# EAGLE design Anchor PCB V2 (EAGLE 9.2.0)
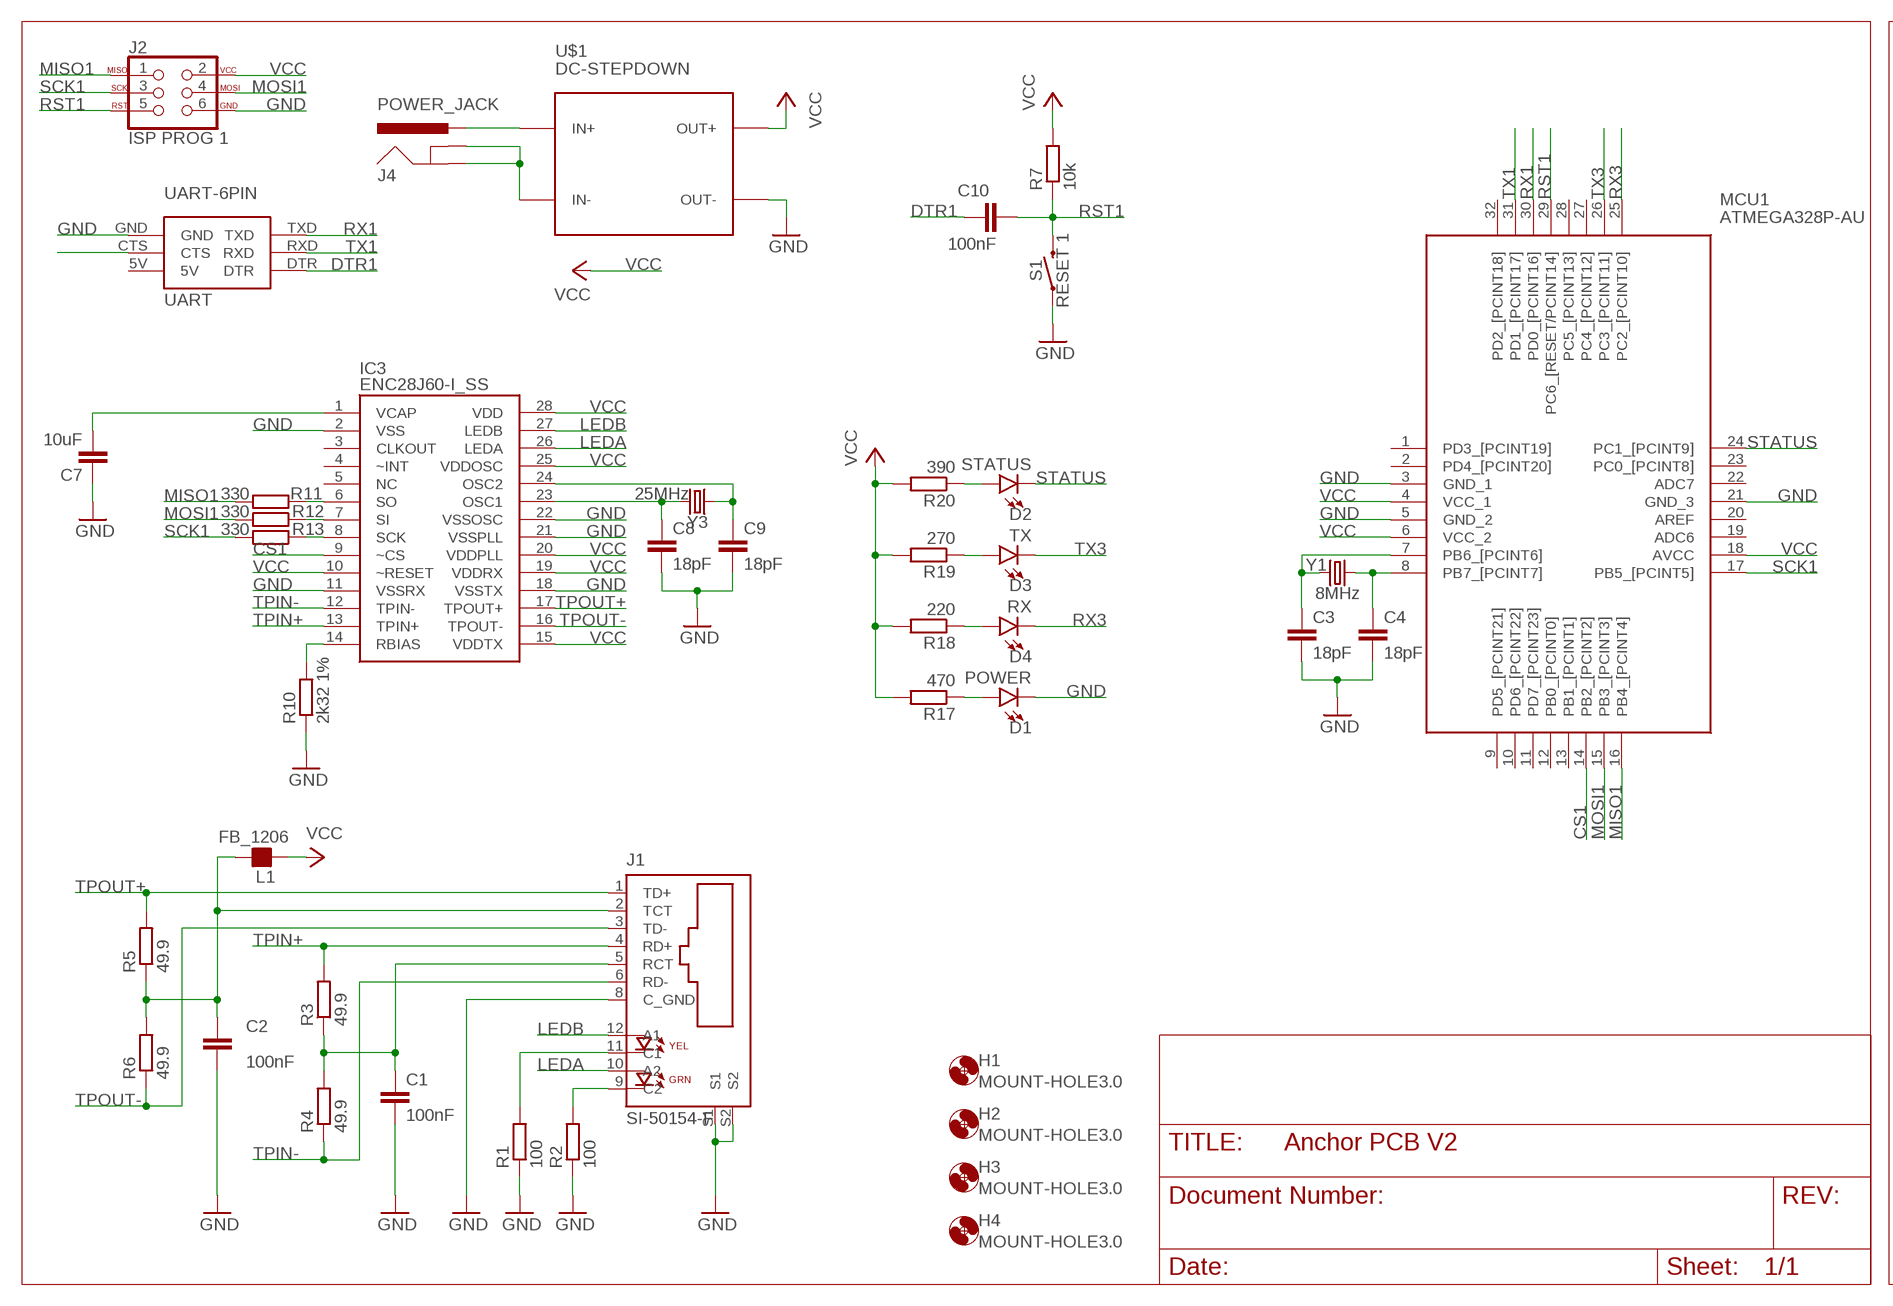
[diagram p0: schematic, sheet 1, part 1 of 2]
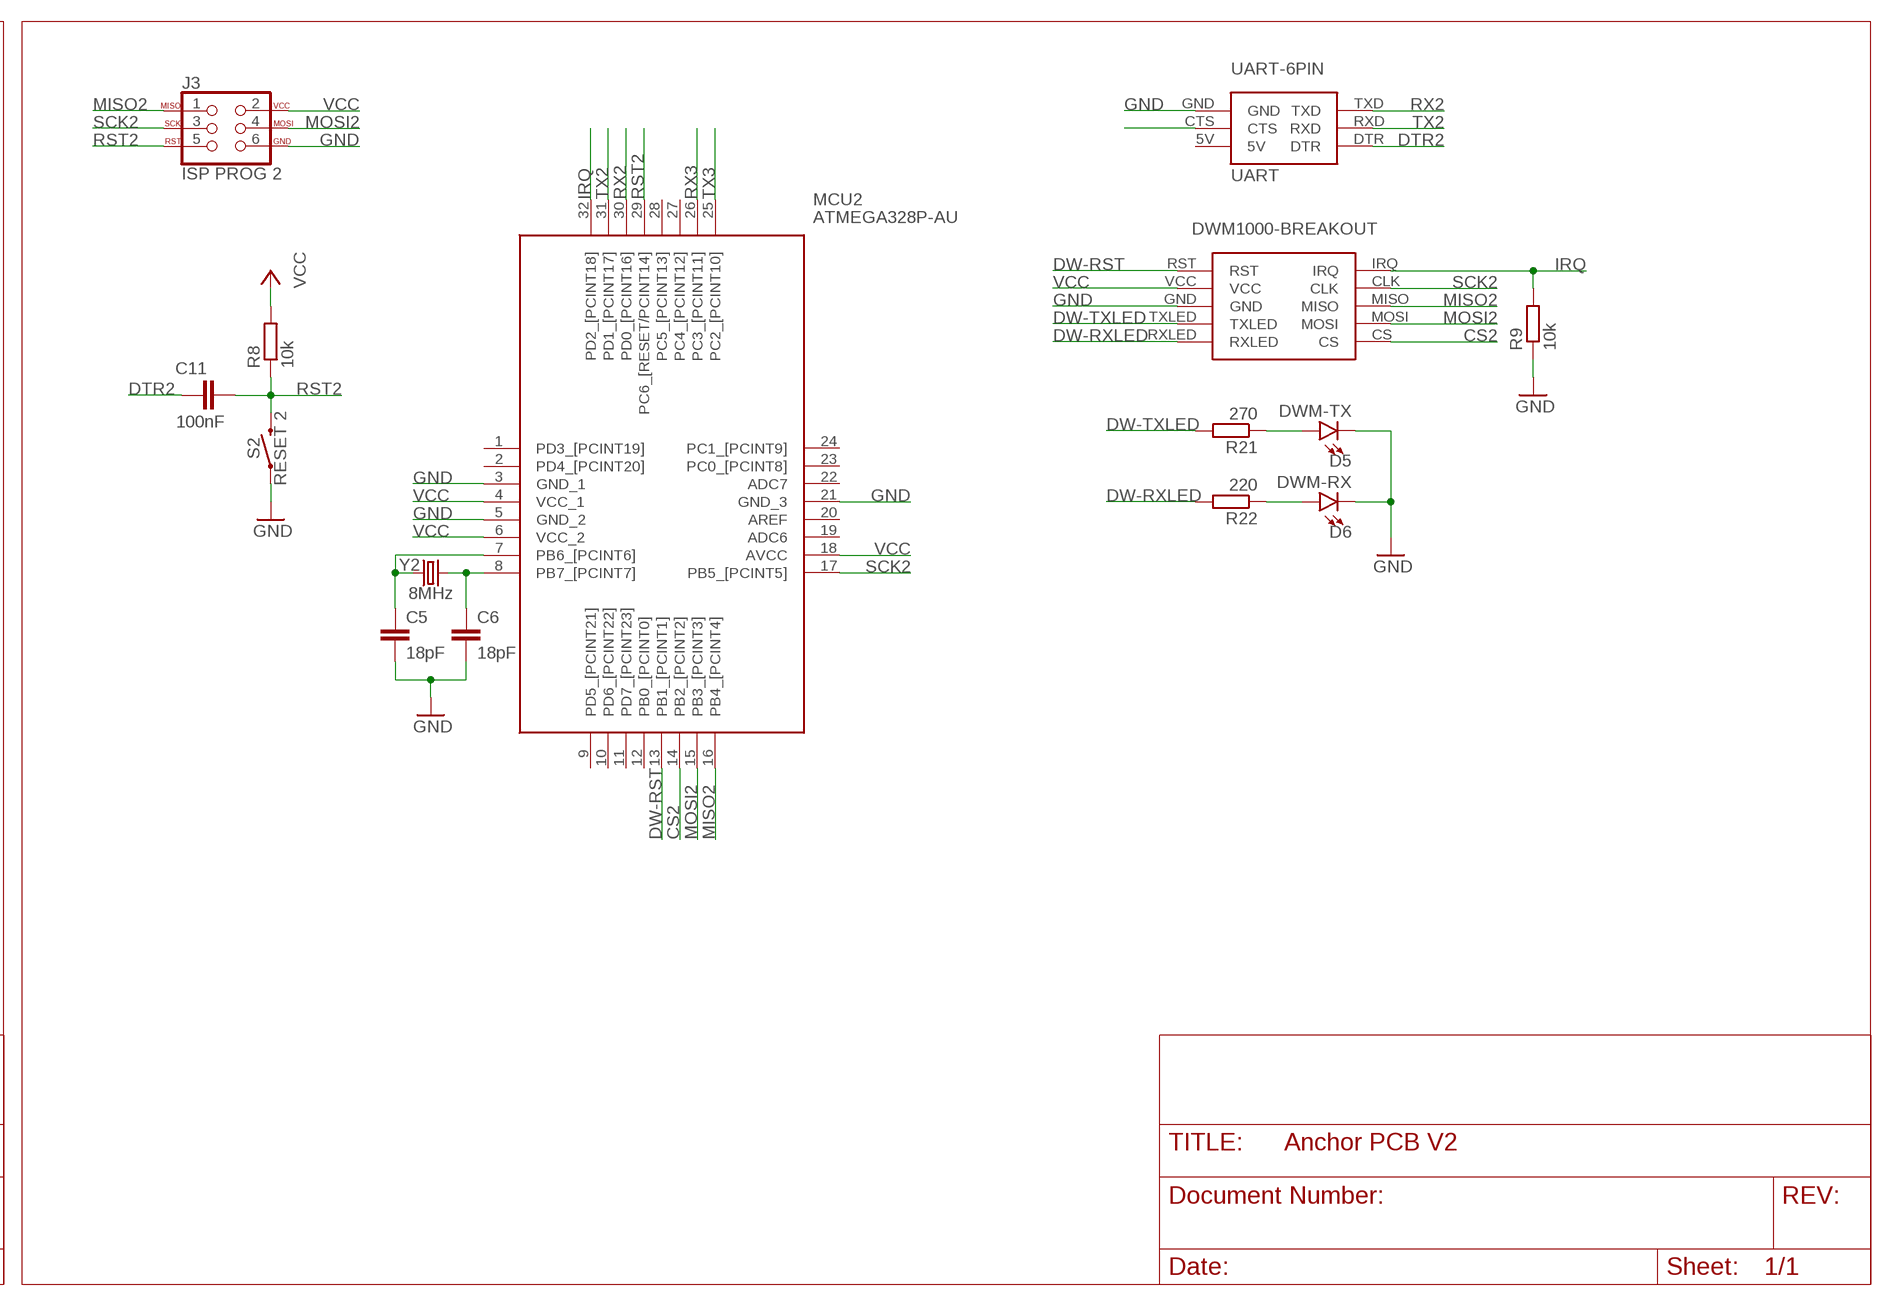
[diagram p1: schematic, sheet 1, part 2 of 2]

## Parts
C1  100nF  C-EUC0805  [C0805]
C2  100nF  C-EUC0805  [C0805]
C3  18pF  C-EUC0805  [C0805]
C4  18pF  C-EUC0805  [C0805]
C5  18pF  C-EUC0805  [C0805]
C6  18pF  C-EUC0805  [C0805]
C7  10uF  C-EUC0805  [C0805]
C8  18pF  C-EUC0805  [C0805]
C9  18pF  C-EUC0805  [C0805]
C10  100nF  C-EUC0805  [C0805]
C11  100nF  C-EUC0805  [C0805]
D1  POWER  LED-BLUE1206  [LED-1206]
D2  STATUS  LED-RED1206  [LED-1206]
D3  TX  LED-YELLOWLILYPAD  [LED-1206]
D4  RX  LED-GREEN1206  [LED-1206]
D5  DWM-TX  LED-YELLOWLILYPAD  [LED-1206]
D6  DWM-RX  LED-GREEN1206  [LED-1206]
H1  MOUNT-HOLE3.0  [3,0]
H2  MOUNT-HOLE3.0  [3,0]
H3  MOUNT-HOLE3.0  [3,0]
H4  MOUNT-HOLE3.0  [3,0]
IC3  ENC28J60-I_SS  [SOP65P780X200-28N]
J1  SI-50154-F  [STEWART_SI-50154-F]
J2  ISP PROG 1  AVR_SPI_PROG_3X2PTH  [2X3]
J3  ISP PROG 2  AVR_SPI_PROG_3X2PTH  [2X3]
J4  POWER_JACK  [POWER_JACK_PTH]
L1  FB_1206  [L1206]
MCU1  ATMEGA328P-AU  [QFP80P900X900X120-32N]
MCU2  ATMEGA328P-AU  [QFP80P900X900X120-32N]
R1  100  R-EU_R0805  [R0805]
R2  100  R-EU_R0805  [R0805]
R3  49.9  R-EU_R1206  [R1206]
R4  49.9  R-EU_R1206  [R1206]
R5  49.9  R-EU_R1206  [R1206]
R6  49.9  R-EU_R1206  [R1206]
R7  10k  R-EU_R0805  [R0805]
R8  10k  R-EU_R0805  [R0805]
R9  10k  R-EU_R0805  [R0805]
R10  2k32 1%  R-EU_R1206  [R1206]
R11  330  R-EU_R0805  [R0805]
R12  330  R-EU_R0805  [R0805]
R13  330  R-EU_R0805  [R0805]
R17  470  R-EU_R1206  [R1206]
R18  220  R-EU_R1206  [R1206]
R19  270  R-EU_R1206  [R1206]
R20  390  R-EU_R1206  [R1206]
R21  270  R-EU_R1206  [R1206]
R22  220  R-EU_R1206  [R1206]
S1  RESET 1  MOMENTARY-SWITCH-SPST-PTH-6.0MM  [TACTILE_SWITCH_PTH_6.0MM]
S2  RESET 2  MOMENTARY-SWITCH-SPST-PTH-6.0MM  [TACTILE_SWITCH_PTH_6.0MM]
U$1  DC-STEPDOWN  DC-DC-STEP-DOWN-LM2596  [DC-DC-STEP-DOWN-LM2596]
U$2  DWM1000  DWM1000-BREAKOUT  [DWM1000-BREAKOUT]
UART1  UART1  UART-6PIN  [UART-6PIN]
UART2  UART2  UART-6PIN  [UART-6PIN]
Y1  8MHz  CRYSTALSMD-HC49UP  [HC49UP]
Y2  8MHz  CRYSTALSMD-HC49UP  [HC49UP]
Y3  25MHz  CRYSTALSMD-HC49UP  [HC49UP]

## Nets
CS1: IC3.9(~CS) MCU1.14(PB2_[PCINT2])
CS2: MCU2.14(PB2_[PCINT2]) U$2.CS
DTR1: C10.1 UART1.DTR
DTR2: C11.1 UART2.DTR
DW-RST: MCU2.13(PB1_[PCINT1]) U$2.RST
DW-RXLED: R22.2 U$2.RXLED
DW-TXLED: R21.2 U$2.TXLED
GND: C1.2 C2.2 C3.2 C4.2 C5.2 C6.2 C7.1 C8.2 C9.2 D1.C D5.C D6.C IC3.2(VSS) IC3.11(VSSRX) IC3.18(VSSTX) IC3.21(VSSPLL) IC3.22(VSSOSC) J1.8(C_GND) J1.S1 J1.S2 J2.6 J3.6 MCU1.3(GND_1) MCU1.5(GND_2) MCU1.21(GND_3) MCU2.3(GND_1) MCU2.5(GND_2) MCU2.21(GND_3) R1.1 R2.1 R9.1 R10.1 S1.1 S2.1 U$1.OUT- U$2.GND UART1.GND UART2.GND
IN+: J4.PWR U$1.IN+
IN-: J4.GND J4.GNDBREAK U$1.IN-
IRQ: MCU2.32(PD2_[PCINT18]) R9.2 U$2.IRQ
LEDA: IC3.26(LEDA) J1.10(A2)
LEDB: IC3.27(LEDB) J1.12(A1)
MISO1: J2.1 MCU1.16(PB4_[PCINT4]) R11.2
MISO2: J3.1 MCU2.16(PB4_[PCINT4]) U$2.MISO
MOSI1: J2.4 MCU1.15(PB3_[PCINT3]) R12.2
MOSI2: J3.4 MCU2.15(PB3_[PCINT3]) U$2.MOSI
N$1: J1.11(C1) R1.2
N$2: J1.9(C2) R2.2
N$3: C3.1 MCU1.7(PB6_[PCINT6]) Y1.2
N$4: C4.1 MCU1.8(PB7_[PCINT7]) Y1.1
N$5: C5.1 MCU2.7(PB6_[PCINT6]) Y2.1
N$6: C6.1 MCU2.8(PB7_[PCINT7]) Y2.2
N$7: C7.2 IC3.1(VCAP)
N$8: IC3.14(RBIAS) R10.2
N$9: C8.1 IC3.23(OSC1) Y3.2
N$10: C9.1 IC3.24(OSC2) Y3.1
N$11: IC3.6(SO) R11.1
N$12: C1.1 J1.5(RCT) R3.1 R4.2
N$13: C2.1 J1.2(TCT) L1.2 R5.1 R6.2
N$14: IC3.7(SI) R12.1
N$15: IC3.8(SCK) R13.1
N$19: UART1.CTS
N$20: D5.A R21.1
N$21: D4.A R18.1
N$22: D2.A R20.1
N$23: UART2.CTS
N$24: D3.A R19.1
N$25: D6.A R22.1
N$26: D1.A R17.1
RST1: C10.2 J2.5 MCU1.29(PC6_[RESET/PCINT14]) R7.1 S1.3
RST2: C11.2 J3.5 MCU2.29(PC6_[RESET/PCINT14]) R8.1 S2.3
RX1: MCU1.30(PD0_[PCINT16]) UART1.TXD
RX2: MCU2.30(PD0_[PCINT16]) UART2.TXD
RX3: D4.C MCU1.25(PC2_[PCINT10]) MCU2.26(PC3_[PCINT11])
SCK1: J2.3 MCU1.17(PB5_[PCINT5]) R13.2
SCK2: J3.3 MCU2.17(PB5_[PCINT5]) U$2.CLK
STATUS: D2.C MCU1.24(PC1_[PCINT9])
TPIN+: IC3.13(TPIN+) J1.4(RD+) R3.2
TPIN-: IC3.12(TPIN-) J1.6(RD-) R4.1
TPOUT+: IC3.17(TPOUT+) J1.1(TD+) R5.2
TPOUT-: IC3.16(TPOUT-) J1.3(TD-) R6.1
TX1: MCU1.31(PD1_[PCINT17]) UART1.RXD
TX2: MCU2.31(PD1_[PCINT17]) UART2.RXD
TX3: D3.C MCU1.26(PC3_[PCINT11]) MCU2.25(PC2_[PCINT10])
VCC: IC3.10(~RESET) IC3.15(VDDTX) IC3.19(VDDRX) IC3.20(VDDPLL) IC3.25(VDDOSC) IC3.28(VDD) J2.2 J3.2 L1.1 MCU1.4(VCC_1) MCU1.6(VCC_2) MCU1.18(AVCC) MCU2.4(VCC_1) MCU2.6(VCC_2) MCU2.18(AVCC) R7.2 R8.2 R17.2 R18.2 R19.2 R20.2 U$1.OUT+ U$2.VCC
Unconnected: IC3.3(CLKOUT) IC3.4(~INT) IC3.5(NC) MCU1.1(PD3_[PCINT19]) MCU1.2(PD4_[PCINT20]) MCU1.9(PD5_[PCINT21]) MCU1.10(PD6_[PCINT22]) MCU1.11(PD7_[PCINT23]) MCU1.12(PB0_[PCINT0]) MCU1.13(PB1_[PCINT1]) MCU1.19(ADC6) MCU1.20(AREF) MCU1.22(ADC7) MCU1.23(PC0_[PCINT8]) MCU1.27(PC4_[PCINT12]) MCU1.28(PC5_[PCINT13]) MCU1.32(PD2_[PCINT18]) MCU2.1(PD3_[PCINT19]) MCU2.2(PD4_[PCINT20]) MCU2.9(PD5_[PCINT21]) MCU2.10(PD6_[PCINT22]) MCU2.11(PD7_[PCINT23]) MCU2.12(PB0_[PCINT0]) MCU2.19(ADC6) MCU2.20(AREF) MCU2.22(ADC7) MCU2.23(PC0_[PCINT8]) MCU2.24(PC1_[PCINT9]) MCU2.27(PC4_[PCINT12]) MCU2.28(PC5_[PCINT13]) UART1.5V UART2.5V

## Library data of the parts
C1-C11 = rcl:C-EU: CAPACITOR, European symbol; SPICEPREFIX: C
D1 = SparkFun-LED:LED-BLUE: Blue SMD LED Used in manufacturing of various products at SparkFun Packages: 0603 - SMD 0603 package [Product Link] <http://www.digikey.com/product-detail/en/SMLE12BC7TT86/511-1589-2-ND/1641808> 1206 - SMD1206 package [Product Link] <http://www.digikey.com/product-detail/en/lite-on-inc/LTST-C150TBKT/160-1643-1-ND/573584> SparkFun Products: ESP8266 Thing-Dev Board <https://www.sparkfun.com/products/13711> RedBoard <https://www.sparkfun.com/products/12757>; PROD_ID: DIO-09911; VALUE: BLUE
D2 = SparkFun-LED:LED-RED: Red SMD LED Used in manufacturing of most products at SparkFun Packages: 0603 - SMD 0603 package [Product Link] <http://docs.avagotech.com/docs/AV02-0551EN> 0603 SMART - SMD 0603 SMART package ( more efficient and expensive)[Product Link] <http://www.osram-os.com/Graphics/XPic2/00077099_0.pdf> 1206 - SMD1206 package [Product Link] <https://www.sparkfun.com/datasheets/DevTools/LilyPad/Q150OVS4.pdff> SparkFun Products: Pro Mini 328 -5V <https://www.sparkfun.com/products/821> RedBoard <https://www.sparkfun.com/products/12757> IOIO-OTG <https://www.sparkfun.com/products/13613>; PROD_ID: DIO-09912; SPICEPREFIX: D; VALUE: RED
D3 D5 = SparkFun-LED:LED-YELLOW: Yellow SMD LED Used in manufacturing several products at SparkFun. Packages: 0603 - SMD 0603 package[Product Link] <http://www.kingbrightusa.com/product.asp?catalog_name=LED&product_id=APT1608SYCK> 0603 -SMART - SMART SMD 0603 package (more efficient/more expensive) [Product Link] <http://www.osram-os.com/osram_os/en/products/product-catalog/led-light-emitting-diodes/smartled-0603/ly-l29k/index.jsp> LilyPad - SMD1206 package[Product Datasheet] <https://www.sparkfun.com/datasheets/DevTools/LilyPad/Q150YUS4.pdf> SparkFun Products: Blynk Board <https://www.sparkfun.com/products/13794> IOIO-OTG <https://www.sparkfun.com/products/13613> XBee Explorer Serial <https://www.sparkfun.com/products/13225>; PROD_ID: DIO-09909; SPICEPREFIX: D; VALUE: Yellow
D4 D6 = SparkFun-LED:LED-GREEN: Green SMD LED Used in manufacturing of various products at SparkFun Packages: 0603 - SMD 0603 package [Product Link] <http://www.futureelectronics.com/en/technologies/semiconductors/optoelectronics/leds/Pages/9894312-LTST-C190GKT.aspx?CrossPart=HSMG-C190&IM=0> LilyPad 1206 - SMD1206 LilyPad package [Product Link] <http://www.futureelectronics.com/en/Technologies/Product.aspx?ProductID=IN150NGHARVATEKCORPORATION2049943&IM=0> 1206 - SMD1206 package [Product Link] <http://www.futureelectronics.com/en/technologies/semiconductors/optoelectronics/leds/Pages/8315665-LTST-C150KGKT.aspx?IM=0> 1206 Bottom Mount -SMD 1206 Bottom Mount [Product Link] <http://www.digikey.com/product-detail/en/lite-on-inc/LTST-C230KGKT/160-1456-1-ND/386854> SparkFun Products: Pro Mini 328 -5V <https://www.sparkfun.com/products/821> RedBoard <https://www.sparkfun.com/products/12757> MP3 Trigger <https://www.sparkfun.com/products/13720> Makey Makey <https://www.sparkfun.com/products/11076>; PROD_ID: DIO-00862; SPICEPREFIX: D; VALUE: GREEN
H1-H4 = holes:MOUNT-HOLE: MOUNTING HOLE with drill center marker
IC3 = ENC28J60-I_SS:ENC28J60-I_SS: Stand-Alone Ethernet Controller Source: Datasheet <http://componentsearchengine.com/Datasheets/3/ENC28J60-I_SS.pdf>; ALLIED_NUMBER: 70047510; ALLIED_PRICE-STOCK: https://www.alliedelec.com/microchip-technology-inc-enc28j60-i-ss/70047510/; ARROW_PART_NUMBER: ENC28J60-I/SS; ARROW_PRICE-STOCK: https://www.arrow.com/en/products/enc28j60-iss/microchip-technology; DESCRIPTION: Stand-Alone Ethernet Controller; HEIGHT: mm; MANUFACTURER_NAME: Microchip; MANUFACTURER_PART_NUMBER: ENC28J60-I/SS; RS_PART_NUMBER: 7707755P; RS_PRICE-STOCK: http://uk.rs-online.com/web/p/products/7707755P
J1 = SI-50154-F:SI-50154-F: Conn Telephone/Telecom F 8 POS 2.54mm Solder RA Thru-Hole 12 Terminal 1 Port; AVAILABILITY: Unavailable; DESCRIPTION: Conn RJ-45 Integrated Magnetics F 8 POS 2.54mm Solder RA Thru-Hole 12 Terminal 1 Port; MF: Stewart Connector; MP: SI-50154-F; PACKAGE: None; PRICE: None
J2 J3 = SparkFun-Connectors:AVR_SPI_PROG_3X2: AVR ISP 6 Pin This is the reduced ISP connector for AVR programming. Common on Arduino. This footprint will take up less PCB space and can be used with a 10-pin to 6-pin adapter such as SKU: BOB-08508 **Special note about "TEST_POINT" package. The stop mask is on the top side, so if you want your programming test points to be on the bottom of your board, make sure to place this package on the bottom side of the board. This also ensure that the orientation to program from the bottom side will be correct. SparkFun Products: SparkFun ISP Pogo Adapter <https://www.sparkfun.com/products/11591> - NS Tiny AVR Programmer <https://www.sparkfun.com/products/11801> -PTH
J4 = SparkFun-Connectors:POWER_JACK: Power Jack Connector This is the standard 5.5mm barrel jack for power. The PTH is the most common, proven, reliable, footprint. The Slot footprint only works if the mill layer is transmitted to the PCB fab house so be warned. Here are the connectors we sell at SparkFun: DC Barrel Power Jack/Connector <https://www.sparkfun.com/products/119> (PRT-00119) DC Barrel Power Jack/Connector (SMD) <https://www.sparkfun.com/products/12748> (PRT-12748) DC Barrel Jack Adapter - Breadboard Compatible <https://www.sparkfun.com/products/10811> (PRT-10811) It is used on this SparkFun product (and many, many others): SparkFun RedBoard - Programmed with Arduino <https://www.sparkfun.com/products/12757> (DEV-12757) Also, if you need a mating power supply or connector, please check these out: Wall Adapter Power Supply - 9VDC 650mA <https://www.sparkfun.com/products/298> (TOL-00298) DC Barrel Jack Adapter - Male <https://www.sparkfun.com/products/10287> (PRT-10287); PROD_ID: CONN-08197
L1 = rc-master-smd:FB_: FERRITE BEAD
MCU1 MCU2 = ATMEGA328P-AU:ATMEGA328P-AU: MICROCHIP - ATMEGA328P-AU. - MICROCONTROLLER MCU, 8 BIT, ATMEGA, 20MHZ, TQFP-32 Source: Datasheet <https://componentsearchengine.com/Datasheets/2/ATMEGA328P-AU.pdf>; ARROW_PART_NUMBER: ATMEGA328P-AU; ARROW_PRICE-STOCK: https://www.arrow.com/en/products/atmega328p-au/microchip-technology; DESCRIPTION: MICROCHIP - ATMEGA328P-AU. - MICROCONTROLLER MCU, 8 BIT, ATMEGA, 20MHZ, TQFP-32; HEIGHT: 1.2mm; MANUFACTURER_NAME: Microchip; MANUFACTURER_PART_NUMBER: ATMEGA328P-AU; RS_PART_NUMBER: 1310271; RS_PRICE-STOCK: http://uk.rs-online.com/web/p/products/1310271
R1-R13 R17-R22 = rcl:R-EU_: RESISTOR, European symbol; SPICEPREFIX: R
S1 S2 = SparkFun-Switches:MOMENTARY-SWITCH-SPST: Momentary Switch (Pushbutton) - SPST Normally-open (NO) SPST momentary switches (buttons, pushbuttons). Variants PTH-12MM - 12mm square, through-hole Momentary Pushbutton Switch - 12mm Square <https://www.sparkfun.com/products/9190> (COM-09190) PTH-6.0MM, PTH-6.0MM-KIT - 6.0mm square, through-hole Mini Pushbutton Switch <https://www.sparkfun.com/products/97> (COM-00097) KIT package intended for soldering kit's - only one side of pads' copper is exposed. PTH-RIGHT-ANGLE-KIT - Right-angle, through-hole Right Angle Tactile Button <https://www.sparkfun.com/products/10791> - Used on SparkFun BigTime Watch Kit <https://www.sparkfun.com/products/11734> SMD-12MM - 12mm square, surface-mount Tactile Button - SMD (12mm) <https://www.sparkfun.com/products/12993> (COM-12993) Used on SparkFun PicoBoard <https://www.sparkfun.com/products/11888> SMD-4.5MM - 4.5mm Square Trackball Switch Used on SparkFun Blackberry Trackballer Breakout <https://www.sparkfun.com/products/13169> SMD-4.6MMX2.8MM - 4.60mm x 2.80mm, surface mount Used on SparkFun SAMD21 Mini Breakout <https://www.sparkfun.com/products/13664> SMD-5.2MM, SMD-5.2-REDUNDANT - 5.2mm square, surface-mount Mini Pushbutton Switch - SMD <https://www.sparkfun.com/products/8720> (COM-08720) Used on Arduino Pro Mini <https://www.sparkfun.com/products/11114> REDUNDANT package connects both switch circuits together SMD-6.0X3.5MM - 6.0 x 3.5mm, surface mount Momentary Reset Switch SMD <https://www.sparkfun.com/products/8229> (COM-08229) SMD-6.2MM-TALL - 6.2mm square, surface mount Tactile Button - SMD (6mm) <https://www.sparkfun.com/products/12992> Used on SparkFun Digital Sandbox <https://www.sparkfun.com/products/12651> SMD-RIGHT-ANGLE - Right-angle, surface mount Used on SparkFun Block for Intel® Edison - Arduino <https://www.sparkfun.com/products/13036>; PROD_ID: SWCH-08441; SF_SKU: COM-00097
U$1 = 1484249208697-powermodules:DC-DC-STEP-DOWN-LM2596: DC/DC Step-Down Regulator based on LM2596-ADJ chip
U$2 = Eigen Library:DWM1000-BREAKOUT
UART1 UART2 = Eigen Library:UART-6PIN
Y1-Y3 = SparkFun-Clocks:CRYSTAL: Crystals (Generic) These are passive quartz crystals, which can be used as a clock source for a microcontroller. Crystal's are two-terminal devices. They require external "load" capacitors to generate an oscillating signal.

## Board
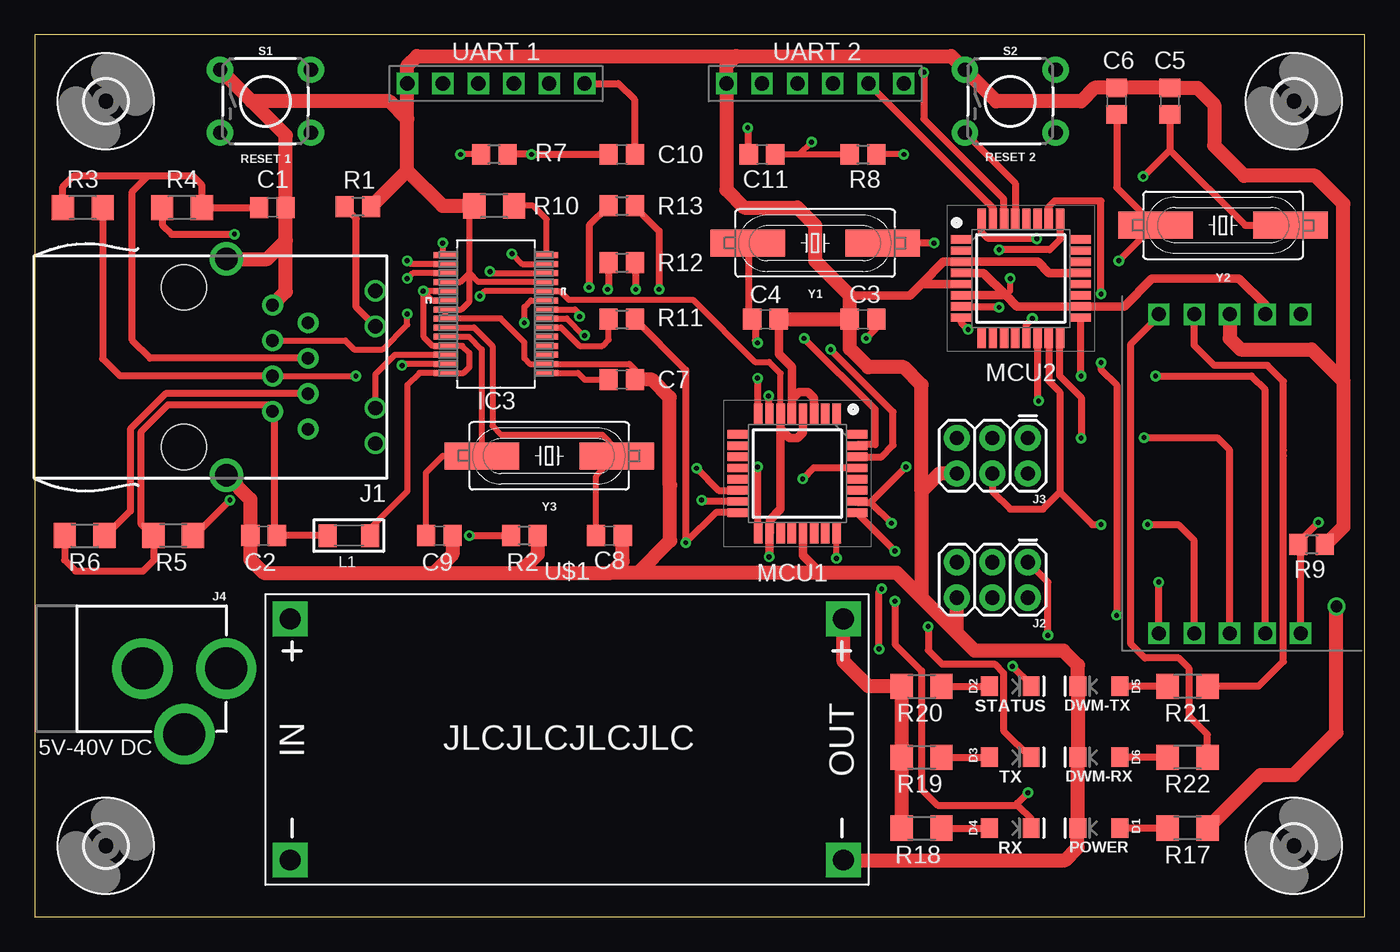
[diagram p2: board, top side]
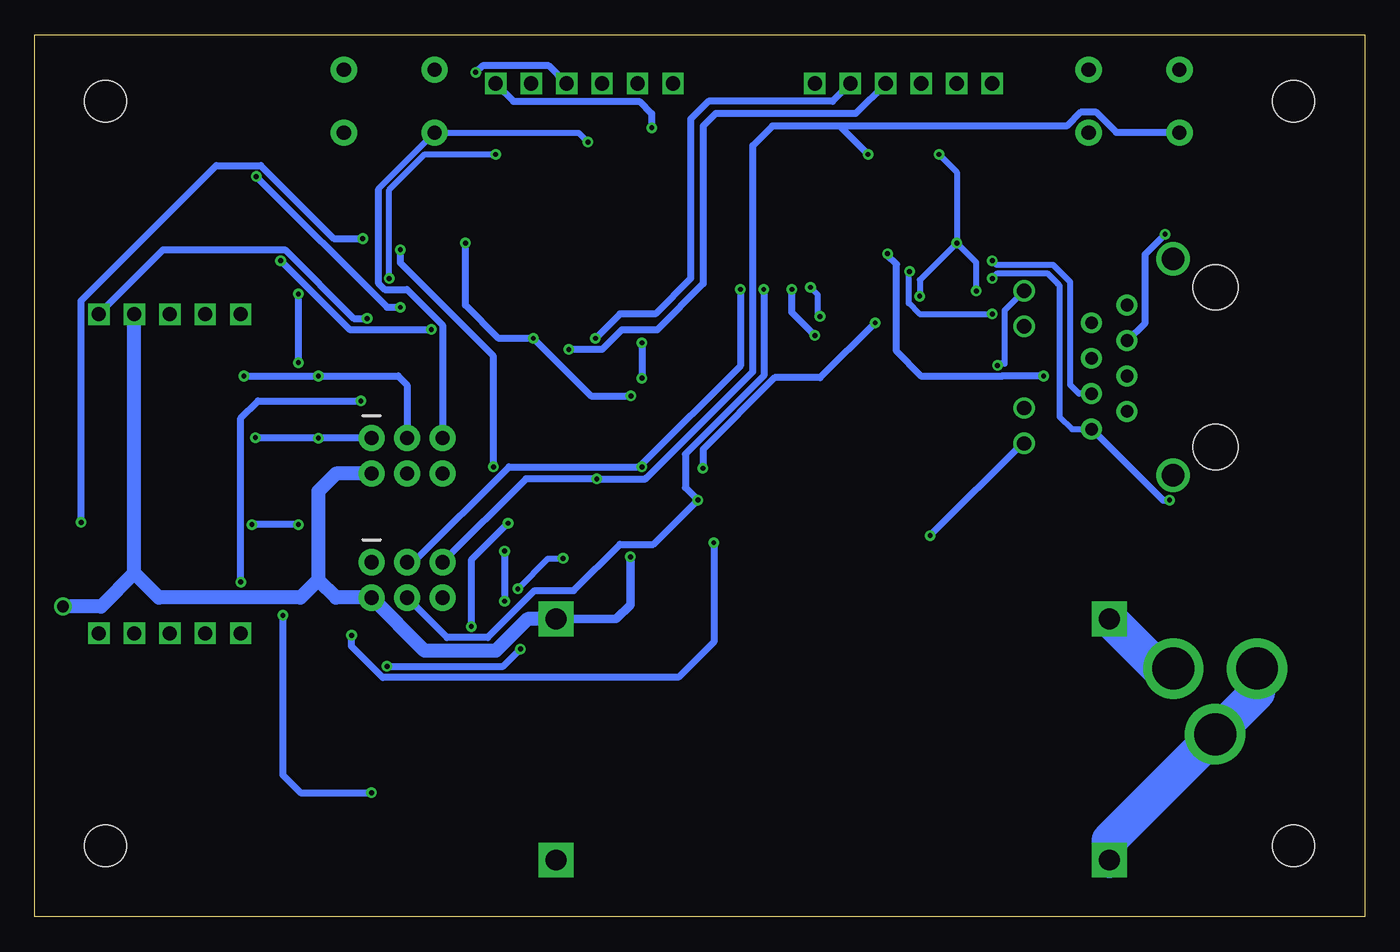
[diagram p3: board, bottom side, seen from below]

Size 95.23 x 63.17 mm. Coordinates in mm from the lower left corner, seen from the top.
Outline: 0,0 95.23,0 95.23,63.17 0,63.17 0,0
Copper layers (1*16): Top 0.035mm / dielectric 1.5mm / Bottom 0.035mm
Design rules "default *": minimum track width 17mil, minimum drill 0.35mm, track to track 6mil, track to pad 6mil, pad to pad 6mil, via to via 6mil, smd to smd 6mil, copper to edge 40mil, drill to drill 6mil, minimum pad ring 10mil, minimum via ring 8mil, stop-mask expansion 4mil, vias tented up to drill 0mil, thermal gap 10mil

### Footprints (pad centres in the part's own frame; a part is rotated, then mirrored left to right if it is on the bottom)
C0805 = smd 1.3 x 1.5: 1 -0.95,0; 2 0.95,0
LED-1206 = smd 1.2 x 1.4: A -1.5,0; C 1.5,0
3,0 = hole 3: 0,0
SOP65P780X200-28N = smd 1.651 x 0.432: 1 -3.632,4.216; 2 -3.632,3.581; 3 -3.632,2.921; 4 -3.632,2.286; 5 -3.632,1.626; 6 -3.632,0.965; 7 -3.632,0.33; 8 -3.632,-0.33; 9 -3.632,-0.965; 10 -3.632,-1.626; 11 -3.632,-2.286; 12 -3.632,-2.921; 13 -3.632,-3.581; 14 -3.632,-4.216; 15 3.632,-4.216; 16 3.632,-3.581; 17 3.632,-2.921; 18 3.632,-2.286; 19 3.632,-1.626; 20 3.632,-0.965; 21 3.632,-0.33; 22 3.632,0.33; 23 3.632,0.965; 24 3.632,1.626; 25 3.632,2.286; 26 3.632,2.921; 27 3.632,3.581; 28 3.632,4.216
STEWART_SI-50154-F = drill 0.9 pad 1.5: 1 4.445,6.858; 2 3.175,4.318; 3 1.905,6.858; 4 0.635,4.318; 5 -0.635,6.858; 6 -1.905,4.318; 7 -3.175,6.858; 8 -4.445,4.318 | drill 1.016 pad 1.5: 9 5.461,11.684; 10 2.921,11.684; 11 -2.921,11.684; 12 -5.461,11.684 | drill 1.6 pad 2.2: S1 -7.747,1.016; S2 7.747,1.016 | hole 3.251: -5.715,-2.032; 5.715,-2.032
2X3 = drill 1.016 pad 1.88: 1 0,0; 2 0,2.54; 3 2.54,0; 4 2.54,2.54; 5 5.08,0; 6 5.08,2.54
POWER_JACK_PTH = drill 2.997 pad 4.318: GND 0,7.7; GNDBREAK 4.7,10.7; PWR 0,13.7
L1206 = smd 1.3 x 1.6: 1 -1.524,0; 2 1.524,0
QFP80P900X900X120-32N = smd 1.5 x 0.6: 1 -4.25,2.8; 2 -4.25,2; 3 -4.25,1.2; 4 -4.25,0.4; 5 -4.25,-0.4; 6 -4.25,-1.2; 7 -4.25,-2; 8 -4.25,-2.8; 17 4.25,-2.8; 18 4.25,-2; 19 4.25,-1.2; 20 4.25,-0.4; 21 4.25,0.4; 22 4.25,1.2; 23 4.25,2; 24 4.25,2.8 | smd 0.6 x 1.5: 9 -2.8,-4.25; 10 -2,-4.25; 11 -1.2,-4.25; 12 -0.4,-4.25; 13 0.4,-4.25; 14 1.2,-4.25; 15 2,-4.25; 16 2.8,-4.25; 25 2.8,4.25; 26 2,4.25; 27 1.2,4.25; 28 0.4,4.25; 29 -0.4,4.25; 30 -1.2,4.25; 31 -2,4.25; 32 -2.8,4.25
R0805 = smd 1.3 x 1.5: 1 -0.95,0; 2 0.95,0
R1206 = smd 1.6 x 1.803: 1 -1.422,0; 2 1.422,0
TACTILE_SWITCH_PTH_6.0MM = drill 1.016 pad 1.88: 1 -3.251,2.261; 2 3.251,2.261; 3 -3.251,-2.261; 4 3.251,-2.261
DC-DC-STEP-DOWN-LM2596 = drill 1.5 pad 2.5 square: IN+ -19.812,8.636; IN- -19.812,-8.636; OUT+ 19.812,8.636; OUT- 19.812,-8.636
DWM1000-BREAKOUT = drill 1.02 pad 1.5 square: CLK 11.444,-3.328; CS 11.444,-10.948; GND -11.416,-5.868; IRQ 11.444,-0.788; MISO 11.444,-5.868; MOSI 11.444,-8.408; RST -11.416,-0.788; RXLED -11.416,-10.948; TXLED -11.416,-8.408; VCC -11.416,-3.328
UART-6PIN = drill 1.02 pad 1.5 square: 5V 5.08,0; CTS 2.54,0; DTR 12.7,0; GND 0,0; RXD 10.16,0; TXD 7.62,0
HC49UP = smd 5.334 x 1.93: 1 -4.826,0; 2 4.826,0

### Placement (x,y rotation side)
C1  17.02,50.8 0 top
C2  16.38,27.3 180 top
C3  59.31,42.8 180 top
C4  52.32,42.8 0 top
C5  81.28,58.42 90 top
C6  77.47,58.42 90 top
C7  42.04,38.48 180 top
C8  41.15,27.3 0 top
C9  28.96,27.3 0 top
C10  42.04,54.61 180 top
C11  52.07,54.61 0 top
D1  76.2,6.35 180 top
D2  69.85,16.51 0 top
D3  69.85,11.43 0 top
D4  69.85,6.35 0 top
D5  76.2,16.51 180 top
D6  76.2,11.43 180 top
H1  5.08,58.42 0 top
H2  90.17,58.42 0 top
H3  90.17,5.08 0 top
H4  5.08,5.08 0 top
IC3  33.02,43.18 180 top
J1  12.7,39.37 270 top
J2  71.12,25.4 180 top
J3  71.12,34.29 180 top
J4  0,17.78 270 top
L1  22.48,27.3 180 top
MCU1  54.61,31.75 270 top
MCU2  70.61,45.72 0 top
R1  23.13,50.85 180 top
R2  35.05,27.3 180 top
R3  3.43,50.8 0 top
R4  10.54,50.8 0 top
R5  9.91,27.3 0 top
R6  3.56,27.3 180 top
R7  32.89,54.61 180 top
R8  59.31,54.61 0 top
R9  91.44,26.67 180 top
R10  32.89,50.93 0 top
R11  42.04,42.8 0 top
R12  42.04,46.86 0 top
R13  42.04,50.93 0 top
R17  82.55,6.35 0 top
R18  63.5,6.35 180 top
R19  63.5,11.43 180 top
R20  63.5,16.51 180 top
R21  82.55,16.51 0 top
R22  82.55,11.43 0 top
S1  16.51,58.42 0 top
S2  69.85,58.42 0 top
U$1  38.1,12.7 0 top
U$2  91.44,31.75 270 top
UART1  26.67,59.69 0 top
UART2  49.53,59.69 0 top
Y1  55.88,48.26 0 top
Y2  85.09,49.53 180 top
Y3  36.83,33.02 0 top

### Tracks (layer width: path | path; a pad name or v marks a point on that pad's centre or on a via)
CS1  (via drill 0.35)
  Top 0.432: v35.05,42.55 35.05,43.69 35.51,44.15 IC3.9 | 50.29,30.48 MCU1.14
  Top 0.508: MCU1.14 48.98,30.55 v47.39,32.13
  Bottom 0.508: v35.05,42.55 38.99,38.61 42.25,38.61 47.37,33.48 47.37,32.15 v47.39,32.13
CS2  (via drill 0.35)
  Top 0.508: v80.49,23.97 U$2.CS | MCU2.14 71.81,37.03 v71.88,36.96
  Bottom 0.508: v80.49,23.97 80.49,35.72 79.25,36.96 v71.88,36.96
DTR1
  Top 0.508: UART1.DTR 41.78,59.69 42.93,58.55 42.93,54.67 C10.1
DTR2  (via drill 0.35)
  Top 0.508: C11.1 51.28,54.61 51.05,54.83 v51.05,56.51
  Bottom 0.508: UART2.DTR 60.96,58.42 51.94,58.42 51.05,57.53 v51.05,56.51
DW-RST  (via drill 0.35)
  Top 0.508: MCU2.13 71.01,42.44 v71.44,42.86
  Bottom 0.508: v71.44,42.86 72.39,42.86 77.31,47.78 86.04,47.78 U$2.RST
DW-RXLED
  Top 0.508: 83.82,11.43 R22.2 83.97,13.06 82.68,14.35 82.68,17.78 81.92,18.54 79.5,18.54 78.49,19.56 78.49,41.02 78.9,41.43 79.06,41.59 80.49,43.02 U$2.RXLED
DW-TXLED
  Top 0.508: R21.2 87.63,16.51 89.41,18.29 89.41,33.02 89.41,33.4 89.41,38.35 88.27,39.5 84.45,39.5 83.03,40.92 U$2.TXLED
GND
  Top 0.432: IC3.21 30.05,43.51 | IC3.21 30.56,43.51 31.11,44.07 31.11,46.1 | 31.11,46.1 31.11,50.57 R10.1 | IC3.18 30.48,45.47 31.11,46.1 | IC3.11 31.75,45.47 31.11,46.1 | 36.62,39.6 35.46,39.6 35.05,40.01 35.05,41.15 33.35,42.85 IC3.22 IC3.21 | IC3.2 42.57,39.6 42.99,39.18 C7.1
  Top 0.508: 17.94,51.28 C1.2
  Top 0.61: MCU2.21 72.62,46.12 71.83,46.92 MCU2.3 65.08,46.92 63.48,45.32 | 58.36,44.51 62.67,44.51 63.48,45.32 | MCU2.5 63.48,45.32 | MCU1.5 54.21,37.08 | 54.21,37.08 54.21,39.37 53.27,40.31 C4.2 | MCU1.21 55.01,25.89 56.26,24.64 | MCU1.3 55.81,37.15 55.37,37.59 54.72,37.59 54.21,37.08
  Top 1.016: U$1.OUT- 73.79,4.06 74.68,4.95 74.68,6.33 D1.C D6.C D5.C 74.7,18.01 73.66,19.05 67.31,19.05 66.04,20.32 | 66.04,20.32 J2.6 | J3.6 64.77,31.75 63.5,30.48 | 63.5,30.48 63.5,22.86 | 63.5,22.86 66.04,20.32 | C3.2 58.36,40.7 59.69,39.37 62.23,39.37 63.5,38.1 63.5,30.48 | C4.2 C3.2 | C3.2 58.36,44.51 55.88,46.99 55.88,49.53 54.61,50.8 50.8,50.8 49.53,52.07 UART2.GND 49.53,60.96 50.22,61.65 | 50.22,61.65 27.36,61.65 26.67,60.96 UART1.GND 26.67,57.15 | R1.1 26.67,53.44 | 26.67,53.44 26.67,57.15 | 26.67,53.44 29.18,50.93 R10.1 | 26.67,57.15 25.4,58.42 15.52,58.42 | 15.52,58.42 S1.1 | J1.S1 16.64,47.12 17.97,48.45 | 17.97,48.45 C1.2 17.97,55.97 15.52,58.42 | J1.8 17.97,44.77 17.97,48.45 | J1.S2 15.43,29.91 C2.2 15.43,25.59 16.38,24.64 28.57,24.64 | 28.57,24.64 34.67,24.64 | C8.2 42.1,25.47 41.27,24.64 | C9.2 29.91,25.97 28.57,24.64 | R2.1 36,25.97 34.67,24.64 | 34.67,24.64 41.27,24.64 | 63.5,22.86 61.72,24.64 56.26,24.64 43.18,24.64 | 43.18,24.64 41.27,24.64 | 50.22,61.65 65.63,61.65 S2.1 68.86,58.42 74.93,58.42 75.88,59.37 C6.2 C5.2 83.25,59.37 84.45,58.17 84.45,55.24 86.61,53.09 91.69,53.09 93.71,51.07 93.71,38.37 | U$2.GND 85.57,41.43 86.36,40.64 91.44,40.64 93.71,38.37 | 43.18,24.64 45.49,26.95 45.49,30.91 45.47,30.93 45.47,37.21 44.2,38.48 C7.1 | 93.71,38.37 93.71,27.94 92.44,26.67 R9.1
IN+
  Bottom 2.54: J4.PWR 14.73,17.78 U$1.IN+
IN-
  Bottom 2.54: J4.GND 7.7,16.08 J4.GNDBREAK 18.29,5.49 U$1.IN-
IRQ  (via drill 0.35)
  Top 0.508: U$2.IRQ 90.65,26.67 R9.2 90.81,26.83 90.81,27.15 v91.92,28.26 | v71.75,48.58 68.26,48.58 67.79,49.05 67.79,49.85 MCU2.32
  Bottom 0.508: v71.75,48.58 73.82,48.58 79.06,53.82 82.23,53.82 91.92,44.13 v91.92,28.26
LEDA
  Top 0.432: J1.10 24.38,38.86 25.78,40.26 IC3.26
LEDB  (via drill 0.35)
  Top 0.432: IC3.27 26.39,39.6 v26.29,39.5
  Bottom 0.432: J1.12 25.78,43.43 25.78,39.62 26.16,39.62 v26.29,39.5
MISO1  (via drill 0.35)
  Top 0.508: 43.02,42.7 R11.2 46.61,39.18 v46.61,26.8 48.76,28.95 MCU1.16 | J2.1 72.55,23.97 v72.55,20.16
  Bottom 0.508: v72.55,20.16 72.55,19.37 70.41,17.22 | 70.33,17.14 70.41,17.22 | 70.41,17.22 70.4,17.22 70.33,17.15 49.14,17.15 46.61,19.68 v46.61,26.8
MISO2  (via drill 0.35)
  Top 0.508: v74.93,34.29 74.93,37.21 73.41,38.73 MCU2.16 | U$2.MISO 85.57,33.43 84.68,34.32 v79.44,34.32
  Bottom 0.508: J3.1 v74.93,34.29 79.41,34.29 v79.44,34.32
MOSI1  (via drill 0.35)
  Top 0.508: R12.2 43.02,46.83 43.02,45.56 43.03,45.55 v43.03,44.94 | MCU1.15 47.85,29.75 v47.75,29.84
  Bottom 0.508: J2.4 65.72,20 62.8,20 59.44,23.37 56.64,23.37 53.34,26.67 50.93,26.67 v47.75,29.84 48.64,30.73 48.64,33.15 43.02,38.77 43.03,38.78 v43.03,44.94
MOSI2  (via drill 0.35)
  Top 0.508: J3.4 68.58,30.48 69.85,29.21 72.2,29.21 73.41,30.42 | 73.41,30.42 75.72,28.1 v76.36,28.1 | MCU2.15 72.61,38.39 73.41,37.59 73.41,30.42 | U$2.MOSI 83.03,26.96 81.88,28.1 v79.69,28.1
  Bottom 0.508: v76.36,28.1 v79.69,28.1
N$1
  Top 0.508: J1.11 23.02,43.66 23.02,50.01 22.23,50.8 R1.2
N$2  (via drill 0.35)
  Top 0.508: v31.11,27.3 R2.2
  Bottom 0.508: v31.11,27.3 24.45,33.97 J1.9
N$3  (via drill 0.35)
  Top 0.508: v52.55,37.31 52.55,36.04 MCU1.7 | v59.53,41.43 60.17,42.07 60.17,42.7 C3.1 | 60.8,48.26 Y1.2 v64.39,48.26
  Bottom 0.508: v52.55,37.31 55.4,37.31 v59.53,41.43 62.01,41.43 64.39,43.81 v64.39,48.26
N$4  (via drill 0.35)
  Top 0.508: Y1.1 51.12,48.26 51.12,43.02 51.28,42.86 C4.1 51.59,42.7 51.59,41.27 v51.75,41.12 | v51.75,38.58 51.75,36.04 MCU1.8
  Bottom 0.508: v51.75,41.12 v51.75,38.58
N$5  (via drill 0.35)
  Top 0.508: C5.1 81.28,54.93 | 81.28,54.93 86.68,49.53 Y2.1 | v79.38,53.02 81.28,54.93 | MCU2.7 68.99,43.72 v69.06,43.66
  Bottom 0.508: v69.06,43.66 70.01,43.66 v79.38,53.02
N$6  (via drill 0.35)
  Top 0.508: 80.17,49.53 v77.63,46.99 | 66.52,42.86 MCU2.8 66.36,42.54 v66.83,42.07 | 80.17,49.53 Y2.2 | C6.1 77.47,52.23 80.17,49.53
  Bottom 0.508: v66.83,42.07 72.71,42.07 v77.63,46.99
N$7
  Top 0.432: C7.2 39.37,38.48 38.89,38.96 IC3.1
  Top 0.508: 40.96,38.58 C7.2
N$8
  Top 0.432: IC3.14 36.65,49.96 35.69,50.93 R10.2
  Top 0.508: 34.45,50.8 R10.2
N$9
  Top 0.432: 29.44,42.22 IC3.23 31.45,42.22 32.77,40.89 32.77,35.18 33.4,34.54 40.64,34.54 41.59,33.59 41.59,33.02 | C8.1 40.2,31.56 Y3.2
  Top 0.508: 40.96,32.38 41.59,33.02 Y3.2 | 40.32,27.3 C8.1
N$10
  Top 0.432: IC3.24 31.09,41.55 32,40.64 Y3.1 29.21,33.02 28.01,31.82 C9.1
  Top 0.508: 31.91,33.02 Y3.1 31.75,33.18
N$11
  Top 0.432: IC3.6 37.67,42.22 38.99,40.89 40.64,40.89 41.09,41.34 R11.1
N$12
  Top 0.508: C1.1 R4.2 11.94,50.83 11.94,52.45 11.3,53.09 8.13,53.09 | 2.06,50.8 R3.1 2.01,52.3 2.79,53.09 8.13,53.09 | J1.5 8.26,40.01 6.99,41.27 6.99,51.94 8.13,53.09
N$13
  Top 0.508: L1.2 C2.1 17.14,27.46 17.14,36.2 J1.2 16.83,36.35 16.83,36.67 9.53,36.67 7.62,34.77 7.62,28.1 8.41,27.3 R5.1 8.48,27.23 8.51,27.21 8.51,25.53 7.75,24.77 2.92,24.77 2.13,25.55 R6.2
N$14  (via drill 0.35)
  Top 0.432: IC3.7 38.1,42.85 39.31,41.64 v39.37,41.64
  Top 0.508: v41.02,44.94 41.09,45.01 R12.1
  Bottom 0.508: v39.37,41.64 41.02,43.29 v41.02,44.94
N$15  (via drill 0.35)
  Top 0.432: IC3.8 38.67,43.51 39.01,43.18 v39.01,43
  Top 0.508: R13.1 40.96,50.8 39.69,49.53 v39.69,45.09
  Bottom 0.432: v39.01,43 39.17,43.16 39.17,44.56 v39.69,45.09
N$20
  Top 0.508: R21.1 D5.A
N$21
  Top 0.508: R18.1 D4.A
N$22
  Top 0.508: R20.1 D2.A
N$24
  Top 0.508: R19.1 D3.A
N$25
  Top 0.508: R22.1 D6.A
N$26
  Top 0.508: R17.1 D1.A
RST1  (via drill 0.35)
  Top 0.508: 33.66,54.77 R7.1 v35.56,54.61 C10.2 | MCU1.29 55.77,32.15 v54.99,31.37
  Bottom 0.508: S1.3 13.34,56.2 17.78,56.2 19.21,57.63 20.35,57.63 21.34,56.64 37.59,56.64 | 37.59,56.64 42.42,56.64 43.81,55.24 43.81,43.18 43.81,39.05 50.96,31.91 51.44,31.43 51.5,31.37 v54.99,31.37 60.07,31.37 J2.5 | v35.56,54.61 37.59,56.64
RST2  (via drill 0.35)
  Top 0.432: C11.2 54.74,54.61 | 54.74,54.61 R8.1 | v55.63,55.5 54.74,54.61
  Top 0.508: 70.17,50.01 MCU2.29 70.21,52.55 S2.3
  Bottom 0.432: 70.64,52.07 70.64,52.11 S2.3 56.29,56.16 v55.63,55.5
  Bottom 0.508: J3.5 66.04,42.39 68.58,44.93 70.17,44.93 70.64,45.4 70.64,52.07
RX1  (via drill 0.35)
  Top 0.508: MCU1.30 60.64,32.95 61.47,33.78 61.47,36.16 v56.99,40.64
  Bottom 0.508: v56.99,40.64 54.61,40.64 53.21,42.04 50.67,42.04 47.37,45.34 47.37,56.64 46.48,57.53 36.45,57.53 UART1.TXD
RX2  (via drill 0.35)
  Top 0.508: v63.66,60.48 63.66,57.15 69.37,51.44 69.37,50.01 MCU2.30
  Bottom 0.508: v63.66,60.48 63.18,60.96 58.42,60.96 UART2.TXD
RX3  (via drill 0.35)
  Top 0.508: v61.59,26.19 58.9,28.89 MCU1.25 | 71.28,6.35 D4.C 71.35,7.01 70.36,8 | v76.36,44.61 76.36,51.28 73.03,51.28 72.55,50.8 72.55,50.01 MCU2.26 | v76.36,39.69 76.36,39.21 77.47,38.1 v77.47,21.59 | v61.59,22.61 61.59,19.53 63.5,17.62 63.5,9.14 64.64,8 70.36,8 | v71.12,8.89 70.36,8.13 70.36,8
  Bottom 0.508: v76.36,39.69 v76.36,44.61 | v61.59,26.19 v61.59,22.61 | v77.47,21.59 77.47,10.16 76.2,8.89 v71.12,8.89
SCK1  (via drill 0.35)
  Top 0.508: R13.2 43.02,50.8 44.7,49.12 v44.7,44.94 | v51.75,32.23 51.75,31.75 51.75,27.62 MCU1.17
  Bottom 0.508: J2.3 68.1,25.4 61.28,32.23 v51.75,32.23 51.75,32.42 44.7,39.47 v44.7,44.94
SCK2  (via drill 0.35)
  Top 0.508: 74.77,42.86 MCU2.17 74.86,38.8 v74.93,38.73 | U$2.CLK 88.11,37.75 87.12,38.73 v80.26,38.73
  Bottom 0.508: J3.3 68.58,38.1 69.22,38.73 v74.93,38.73 v80.26,38.73
STATUS  (via drill 0.35)
  Top 0.432: v57.4,25.68 57.4,27.4 57.47,27.46
  Top 0.508: 71.28,16.51 D2.C 71.35,16.6 v70.01,17.94 | 57.47,27.46 MCU1.24 | v60.45,19.18 60.45,23.3 v60.64,23.49
  Bottom 0.432: v60.64,23.49 58.48,25.65 57.4,25.65 v57.4,25.68
  Bottom 0.508: v70.01,17.94 61.69,17.94 v60.45,19.18
TPIN+  (via drill 0.35)
  Top 0.432: J1.4 v22.99,38.73 | v34.16,47.5 34.9,46.76 IC3.13
  Top 0.508: J1.4 6.1,38.73 4.85,39.98 R3.2 4.92,50.8
  Bottom 0.508: v22.99,38.73 25.94,38.73 25.96,38.71 31.73,38.71 33.53,40.51 33.53,46.74 34.16,47.37 v34.16,47.5
TPIN-  (via drill 0.35)
  Top 0.432: J1.6 22.23,41.27 22.86,40.64 24.89,40.64 26.67,42.42 v26.67,43.18 | v32.59,46.23 32.72,46.1 IC3.12
  Top 0.508: R4.1 9.12,49.55 9.78,48.9 v14.29,48.9
  Bottom 0.432: v32.59,46.23 32.64,46.18 32.64,43.94 31.88,43.18 v26.67,43.18
  Bottom 0.508: v14.29,48.9 15.72,47.47 15.72,42.55 16.99,41.27 J1.6
TPOUT+  (via drill 0.35)
  Top 0.432: IC3.17 27.05,46.1 v26.67,45.72
  Top 0.508: v13.97,29.84 11.43,27.3 R5.2
  Bottom 0.432: v26.67,45.72 26.29,46.1 22.73,46.1 21.97,45.34 21.84,45.21 21.84,35.81 20.95,34.92 J1.1
  Bottom 0.508: v13.97,29.84 14.45,29.84 19.53,34.92 J1.1
TPOUT-  (via drill 0.35)
  Top 0.432: IC3.16 26.9,46.76 v26.67,46.99
  Top 0.508: J1.3 9.37,37.47 6.83,34.92 6.83,29.05 5.08,27.3 R6.1
  Bottom 0.432: J1.3 20.45,37.47 21.08,38.1 21.08,45.47 22.3,46.69 26.36,46.69 v26.67,46.99
TX1  (via drill 0.35)
  Top 0.508: v55.09,41.43 60.17,36.35 60.17,33.81 58.9,33.81 MCU1.31
  Bottom 0.508: UART1.RXD 38.1,58.42 46.99,58.42 48.26,57.15 48.26,45.72 50.8,43.18 53.34,43.18 v55.09,41.43
TX2
  Top 0.508: 68.58,50.01 MCU2.31 68.61,50.8 68.28,51.13 68.25,51.13 UART2.RXD
TX3  (via drill 0.35)
  Top 0.508: 59.85,29.69 58.9,29.69 MCU1.26 | D3.C 71.28,11.43 69.37,13.34 69.37,17.46 68.74,18.1 64.96,18.1 63.98,19.08 v63.98,20.8 | 59.85,29.69 v62.39,32.23 | MCU2.25 73.41,48.52 72.68,47.78 v69.06,47.78 | 59.85,29.69 v61.34,28.19
  Bottom 0.508: v63.98,20.8 63.98,25.56 v61.34,28.19 | v69.06,47.78 69.06,46.83 62.39,40.16 v62.39,32.23
VCC  (via drill 0.35, 0.85)
  Top 0.432: R7.2 v30.48,54.61 | v29.21,48.26 29.21,47.57 IC3.15 | 53.34,36.07 MCU1.6 53.41,38.92 52.58,39.75 51.56,39.75 47.12,44.2 38.23,44.2 37.62,44.81 IC3.10 32.22,44.81 v31.86,44.45 | 69.53,44.52 69.85,44.84 v69.85,45.72 | v62.23,54.61 R8.2 | L1.1 24,27.81 26.67,30.48 26.67,38.1 27.53,38.96 IC3.28 30.71,38.96 31.11,39.37 31.11,40.39 30.61,40.89 IC3.25 29.33,40.89 29.3,40.89 29.29,40.89 28.49,40.89 27.84,41.54 27.84,44.81 | IC3.19 27.84,44.81 | v27.81,44.83 27.84,44.81 | 27.84,44.81 28.5,44.15 IC3.20
  Top 0.61: MCU2.6 69.53,44.52 | 69.53,44.52 70.33,43.72 MCU2.18 78.01,43.72 80.01,45.72 86.23,45.72 88.14,43.81 88.11,43.79 U$2.VCC | MCU2.4 67.93,46.12 69.53,44.52 | v52.58,25.78 52.61,25.81 MCU1.18 52.65,27.54 52.65,28.44 53.41,29.2 53.41,34.92 | 53.41,34.92 MCU1.6 | MCU1.4 55.01,34.69 54.61,34.29 54.05,34.29 53.41,34.92
  Top 1.016: R18.2 R19.2 R20.2 59.69,16.51 57.91,18.29 U$1.OUT+ | R17.2 87.78,10.16 90.17,10.16 93.22,13.21 v93.22,22.23
  Bottom 0.432: v30.48,54.61 29.21,53.34 v29.21,48.26 | v69.85,45.72 69.85,52.07 67.31,54.61 v62.23,54.61 | v31.86,44.45 31.86,45.61 v29.21,48.26 | v27.81,44.83 27.81,46.86 v29.21,48.26
  Bottom 0.61: U$1.OUT+ 53.59,21.34 52.58,22.35 v52.58,25.78
  Bottom 1.016: U$1.OUT+ 59.94,21.34 62.23,19.05 67.31,19.05 J2.2 73.66,22.86 74.93,24.13 | 88.11,24.61 U$2.VCC | J3.2 73.66,31.75 74.93,30.48 74.93,24.13 | 74.93,24.13 76.2,22.86 86.36,22.86 88.11,24.61 | 88.11,24.61 90.5,22.23 v93.22,22.23

### Text on the board
tNames: UART 1 | UART 2 | 5V-40V DC | JLCJLCJLCJLC